# EAGLE design Strain gauge (EAGLE 5.12)
PARTNO: 43045-0615

## Sheet 1 of 2
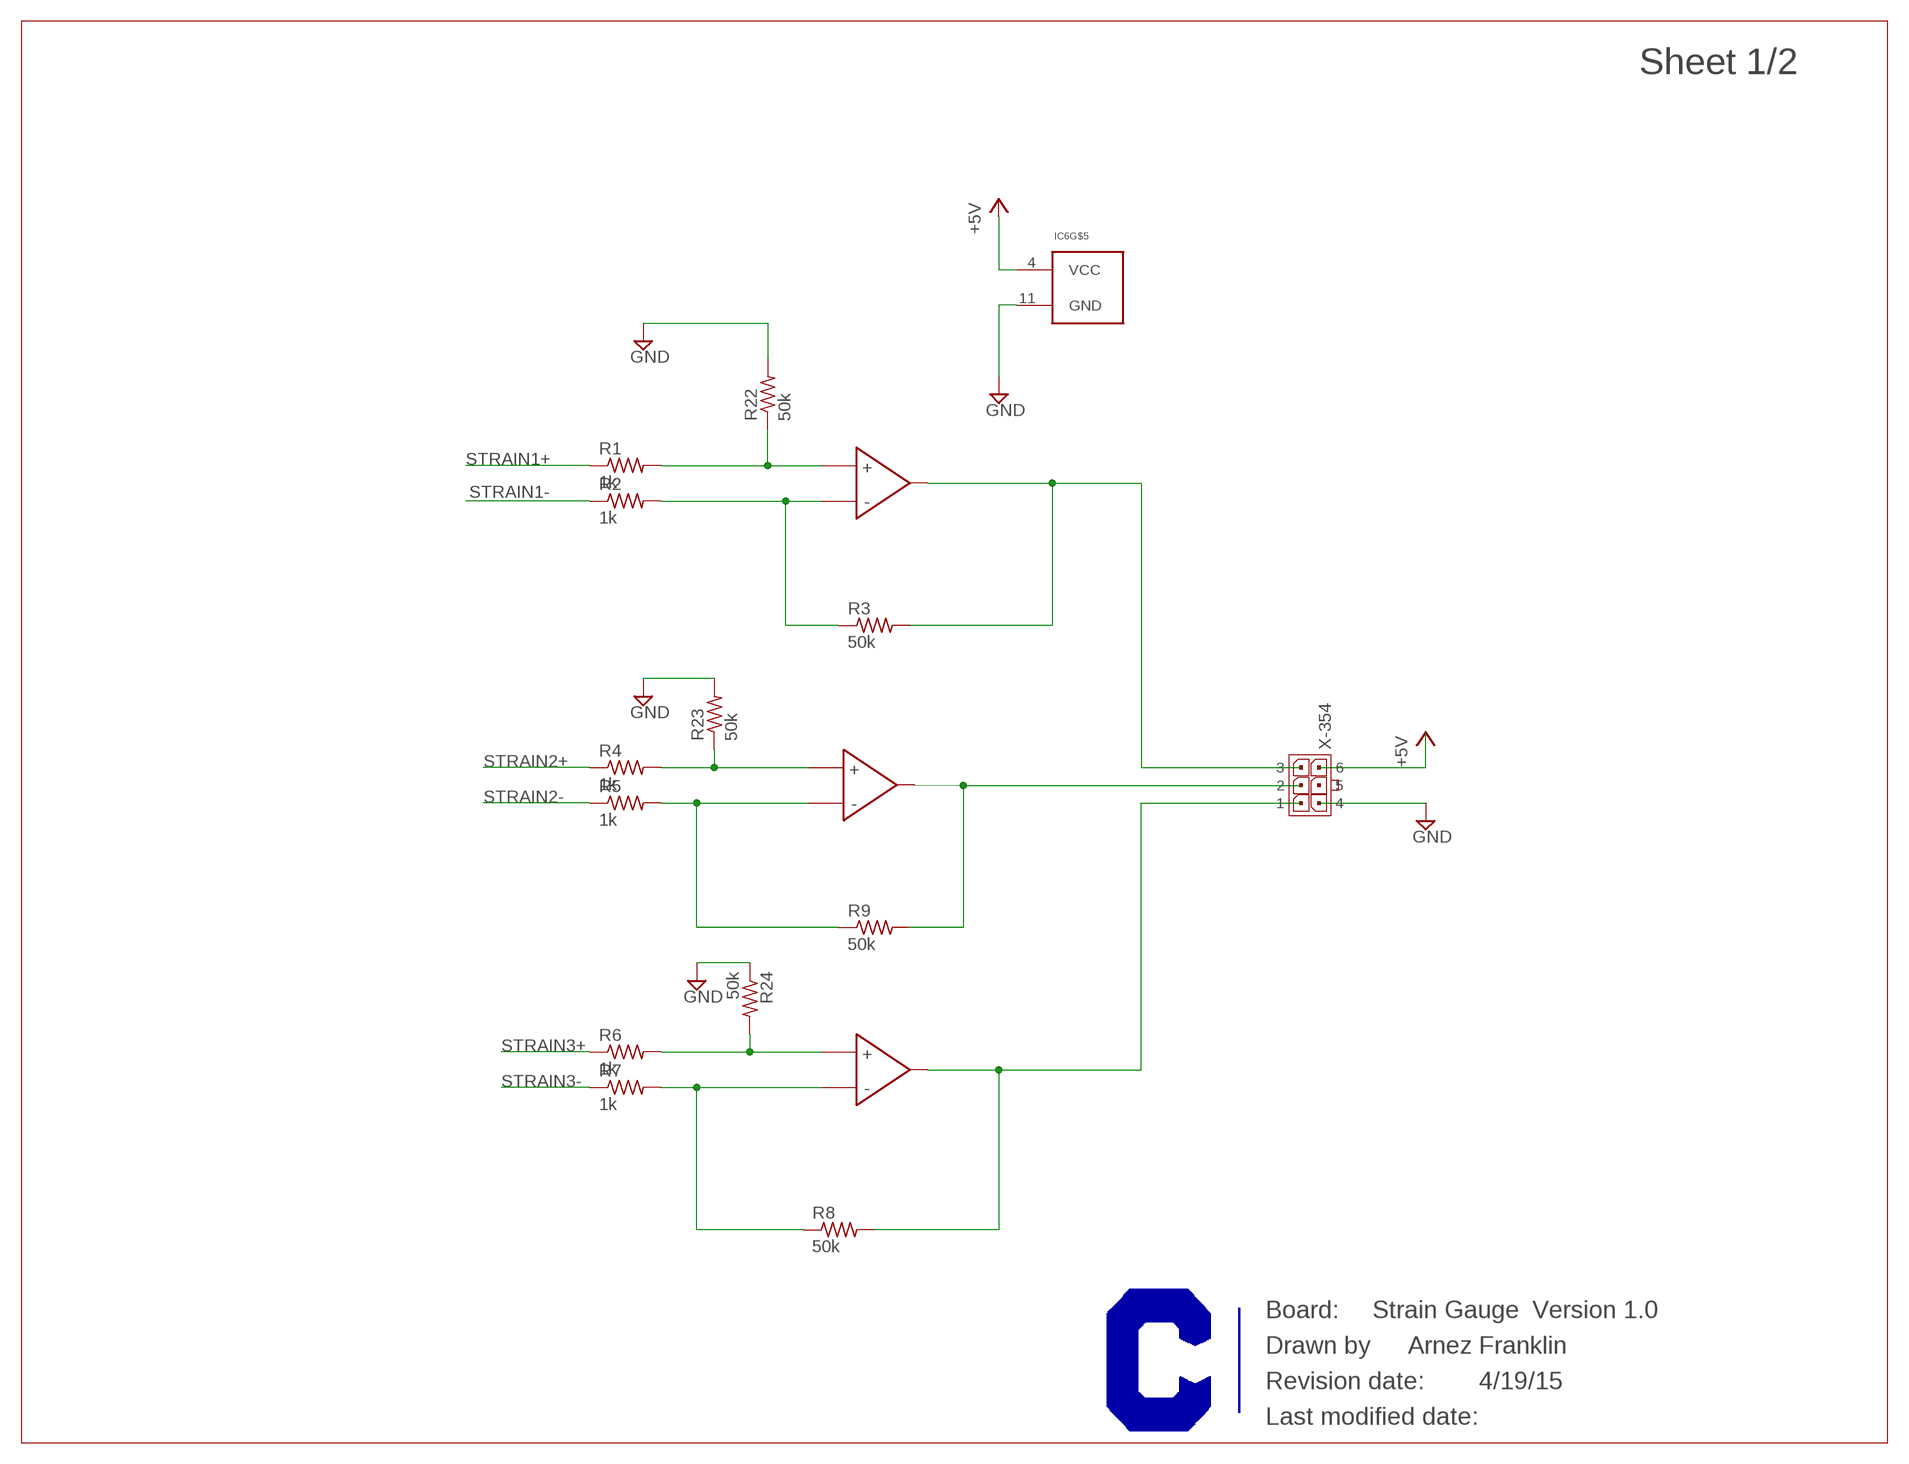
[diagram p0: schematic, sheet 1]

### Parts
IC6  TLV2764IPWR  [PW_(R-PDSO-G14)_(TSSOP-14)]
R1  1k  R-US_R0603  [R0603]
R2  1k  R-US_R0603  [R0603]
R3  50k  R-US_R0603  [R0603]
R4  1k  R-US_R0603  [R0603]
R5  1k  R-US_R0603  [R0603]
R6  1k  R-US_R0603  [R0603]
R7  1k  R-US_R0603  [R0603]
R8  50k  R-US_R0603  [R0603]
R9  50k  R-US_R0603  [R0603]
R22  50k  R-US_R0603  [R0603]
R23  50k  R-US_R0603  [R0603]
R24  50k  R-US_R0603  [R0603]
U$1  CURRENT-C-LETTER-LANDSCAPE  [BLANK]
X-354  MICROFIT-06-DUAL-RA-SMD-CLIP_RETENTION  [MICROFIT-6-DUAL-RA-SMD-CLIP_RETENTION]

### Nets
+5V: IC6.4(VCC) X-354.6 ; also sheet 2
GND: IC6.11(GND) R22.2 R23.2 R24.1 X-354.4 ; also sheet 2
N$1: IC6.3(IN+) R1.2 R22.1
N$2: IC6.2(IN-) R2.2 R3.1
N$3: IC6.7(OUT) R9.2 X-354.2
N$5: IC6.1(OUT) R3.2 X-354.3
N$11: IC6.14(OUT) R8.2 X-354.1
N$15: IC6.6(IN-) R5.2 R9.1
N$16: IC6.5(IN+) R4.2 R23.1
N$17: IC6.13(IN-) R7.2 R8.1
N$18: IC6.12(IN+) R6.2 R24.2
STRAIN1+: R1.1 ; also sheet 2
STRAIN1-: R2.1 ; also sheet 2
STRAIN2+: R4.1 ; also sheet 2
STRAIN2-: R5.1 ; also sheet 2
STRAIN3+: R6.1 ; also sheet 2
STRAIN3-: R7.1 ; also sheet 2
Unconnected: IC6.8(OUT) IC6.9(IN-) IC6.10(IN+) X-354.5

### Notes on the sheet
- Strain Gauge | Version 1.0
- Arnez Franklin
- 4/19/15

## Sheet 2 of 2
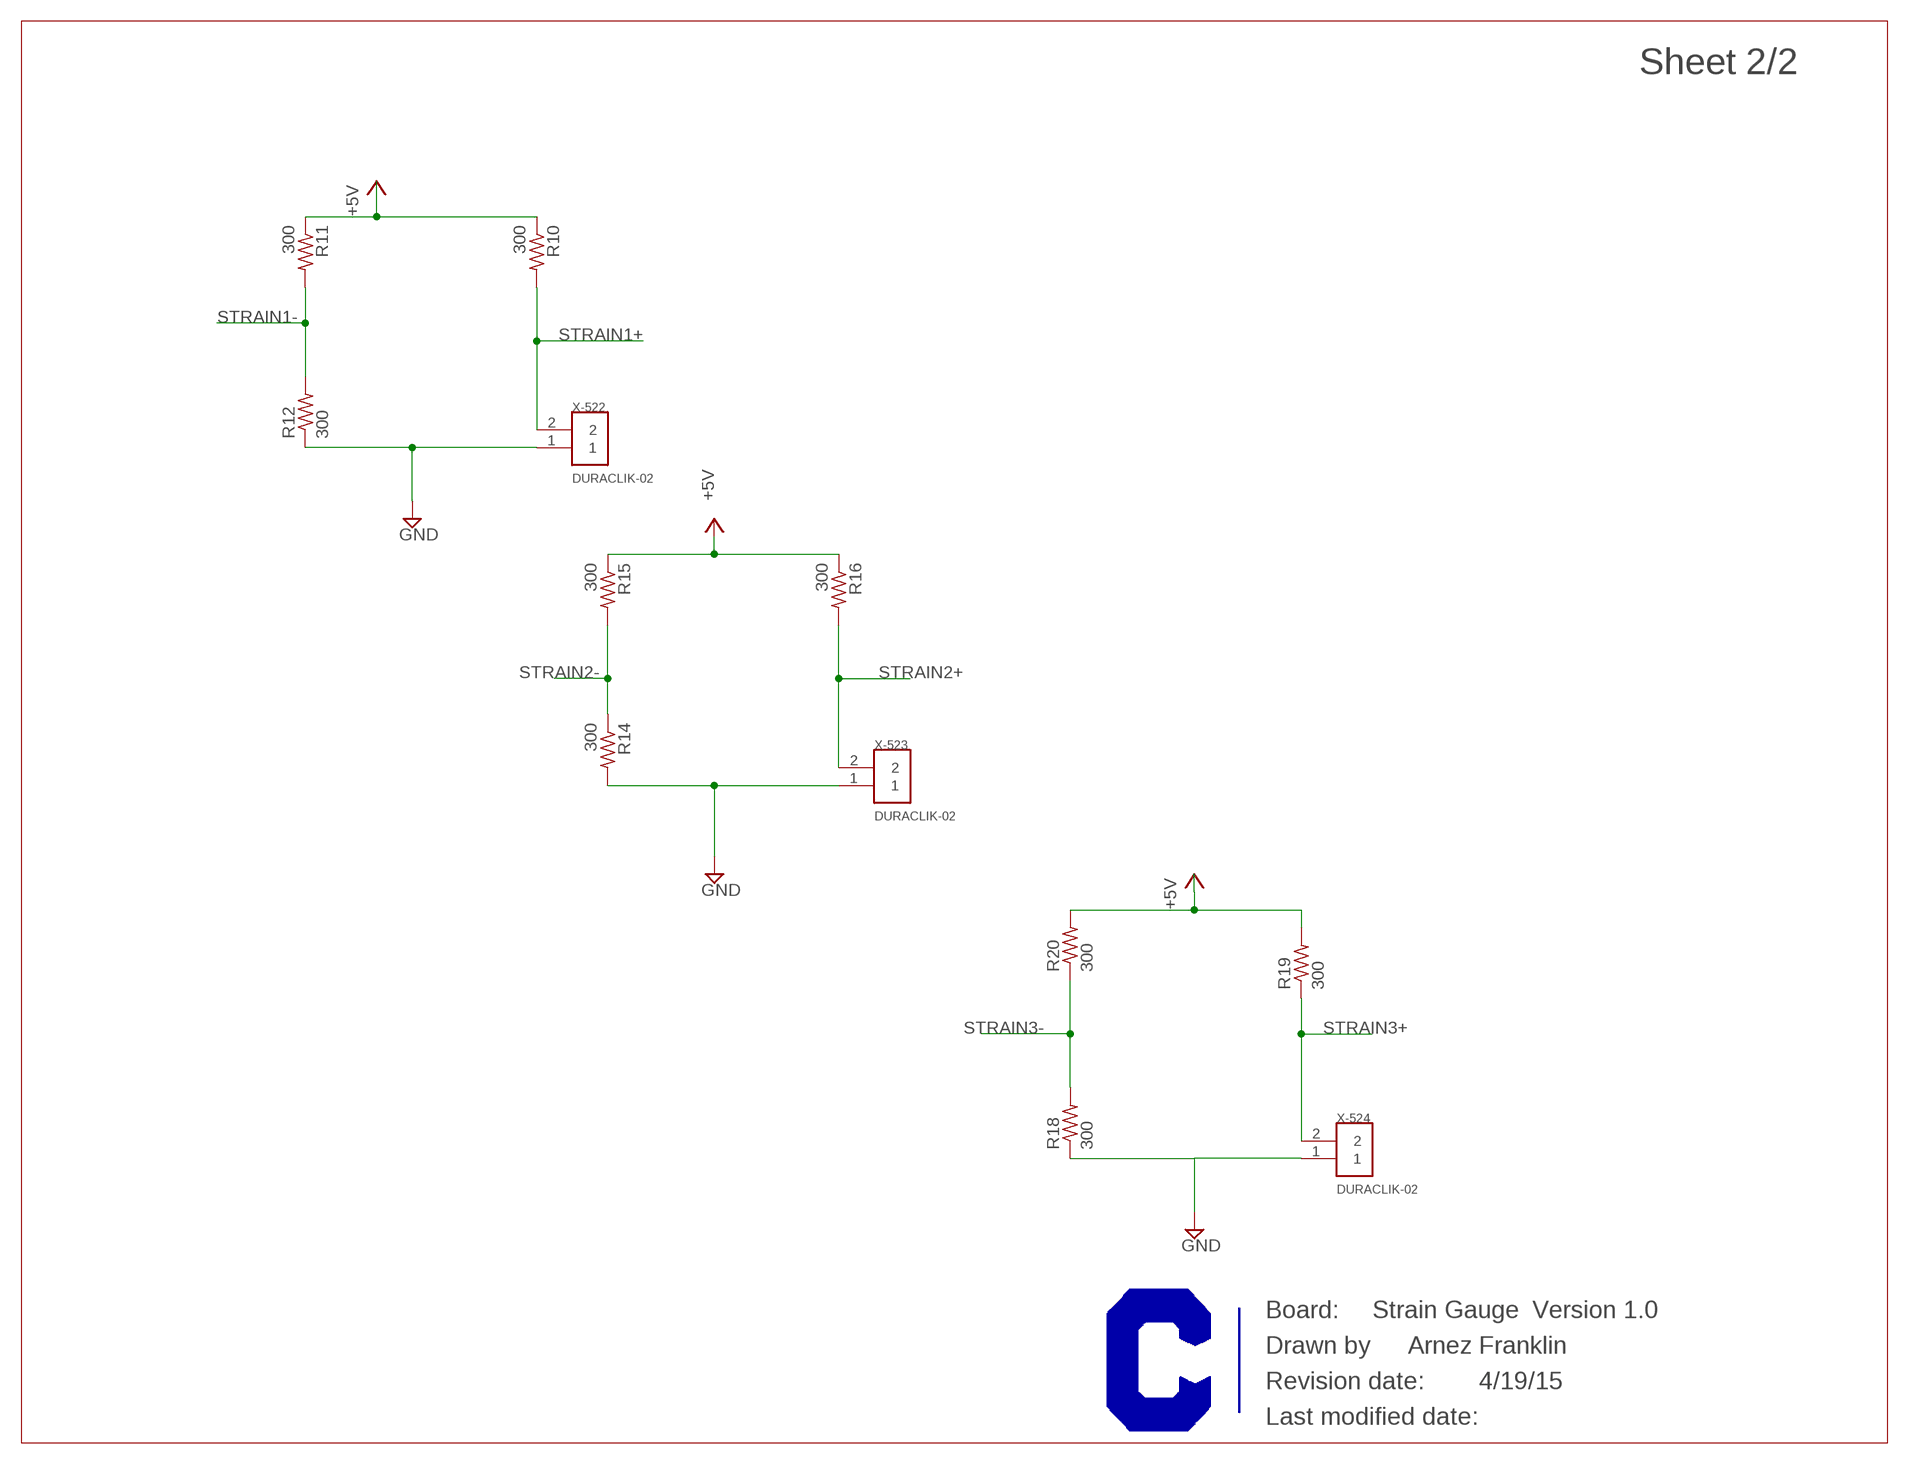
[diagram p1: schematic, sheet 2]

### Parts
R10  300  R-US_R0603  [R0603]
R11  300  R-US_R0603  [R0603]
R12  300  R-US_R0603  [R0603]
R14  300  R-US_R0603  [R0603]
R15  300  R-US_R0603  [R0603]
R16  300  R-US_R0603  [R0603]
R18  300  R-US_R0603  [R0603]
R19  300  R-US_R0603  [R0603]
R20  300  R-US_R0603  [R0603]
U$5  CURRENT-C-LETTER-LANDSCAPE  [BLANK]
X-522  DURACLIK-02  [DURACLIK-02]
X-523  DURACLIK-02  [DURACLIK-02]
X-524  DURACLIK-02  [DURACLIK-02]

### Nets
+5V: R10.1 R11.1 R15.1 R16.1 R19.2 R20.2 ; also sheet 1
GND: R12.1 R14.2 R18.1 X-522.1 X-523.1 X-524.1 ; also sheet 1
STRAIN1+: R10.2 X-522.2 ; also sheet 1
STRAIN1-: R11.2 R12.2 ; also sheet 1
STRAIN2+: R16.2 X-523.2 ; also sheet 1
STRAIN2-: R14.1 R15.2 ; also sheet 1
STRAIN3+: R19.1 X-524.2 ; also sheet 1
STRAIN3-: R18.2 R20.1 ; also sheet 1

### Notes on the sheet
- Strain Gauge | Version 1.0
- Arnez Franklin
- 4/19/15

## Library data of the parts
IC6 = TI:TLV2764: TLV2764 - Micropower, Rail-to-Rail Input/Output Op-Amps with Shutdown Datasheet: http://www.ti.com/lit/ds/symlink/tlv2764.pdf; PARTNO: TLV2764IPWR
R1-R12 R14-R16 R18-R20 = rcl:R-US_: RESISTOR, American symbol
R22-R24 = resistor:R-US_: RESISTOR, American symbol
U$1 U$5 = Frames:CURRENT-C-LETTER-LANDSCAPE; BOM: EXCLUDE
X-354 = Molex:MICROFIT-06-DUAL: Molex MicroFit 3.00mm Pitch Header, Surface Mount, Dual Row, 6 Circuits Note, November 2014: These come in three styles: Through-hole, with metal clip retention to PCB (not currently represented) (cheapest) SMD, with solder tab retention (-SMD) (more expensive, commonly stocked) SMD, with metal clip retention (-SMD-CLIP_RETENTION) (most expensive, not often stocked) Please use them in that order! Drawing: http://www.molex.com/pdm_docs/sd/430450609_sd.pdf (right-angle) Information: http://www.molex.com/molex/products/datasheet.jsp?part=active/0430450618_PCB_HEADERS.xml; PARTNO: 43045-0621
X-522-X-524 = BMC components:DURACLIK-02: MOLEX DuraClik Wire-to-Board Header, Single Row, Right Angle, 2 Circuits Drawing: 5023520600_sd.pdf <http://www.molex.com/pdm_docs/sd/5023520600_sd.pdf> Information: 502352-0200 <http://www.molex.com/molex/products/datasheet.jsp?part=active/5023520200_PCB_HEADERS.xml>

## Board
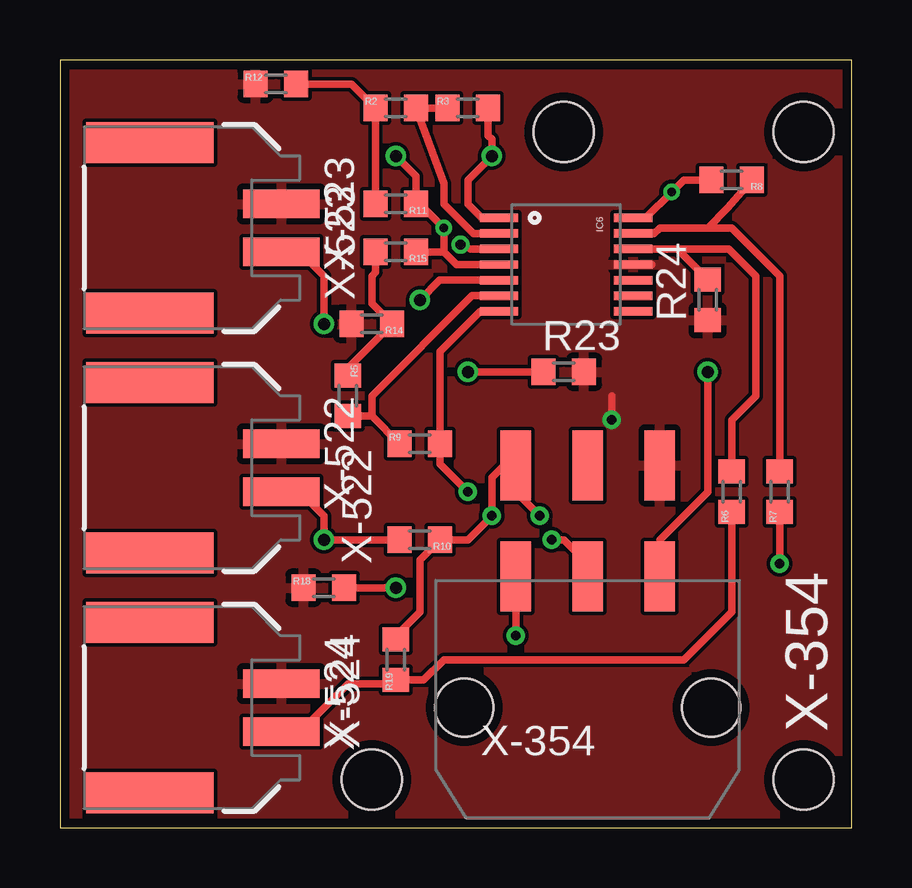
[diagram p2: board, top side]
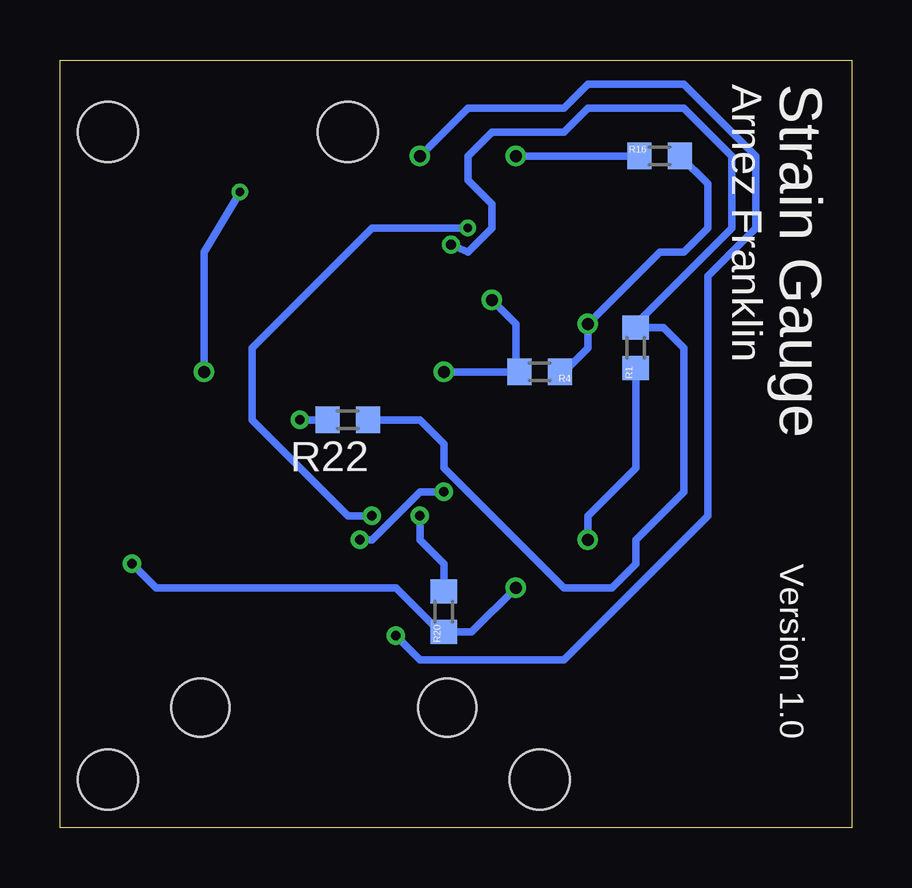
[diagram p3: board, bottom side, seen from below]

Size 33 x 32 mm. Coordinates in mm from the lower left corner, seen from the top.
Outline: 0,0 33,0 33,32 0,32 0,0
Copper layers (1*16): Top 0.0356mm / dielectric 1.5011mm / Bottom 0.0356mm
Design rules "OSH Park 2-layer": minimum track width 6mil, minimum drill 13mil, track to track 6mil, track to pad 6mil, pad to pad 6mil, via to via 6mil, smd to smd 6mil, copper to edge 15mil, drill to drill 6mil, minimum pad ring 7mil, minimum via ring 7mil, stop-mask expansion 4mil, vias tented up to drill 25mil, thermal gap 10mil
Holes 2.5 mm at 21,29 31,29 13,2 31,2

### Footprints (pad centres in the part's own frame; a part is rotated, then mirrored left to right if it is on the bottom)
PW_(R-PDSO-G14)_(TSSOP-14) = smd 0.35 x 1.6: 1 -1.95,-2.8; 2 -1.3,-2.8; 3 -0.65,-2.8; 4 0,-2.8; 5 0.65,-2.8; 6 1.3,-2.8; 7 1.95,-2.8; 8 1.95,2.8; 9 1.3,2.8; 10 0.65,2.8; 11 0,2.8; 12 -0.65,2.8; 13 -1.3,2.8; 14 -1.95,2.8
R0603 = smd 1 x 1.1: 1 -0.85,0; 2 0.85,0
MICROFIT-6-DUAL-RA-SMD-CLIP_RETENTION = smd 1.27 x 2.921: 1 3,5.47; 2 0,5.47; 3 -3,5.47; 4 3,10.1; 5 0,10.1; 6 -3,10.1 | hole 2.413: 5.144,0; -5.144,0
DURACLIK-02 = smd 1.2 x 3.2: 1 -1,8.23; 2 1,8.23 | smd 1.7 x 5.3: P$3 -3.55,2.75; P$4 3.55,2.75

### Placement (x,y rotation side)
IC6  21.1,23.47 270 top
R1  9,20 90 bottom
R2  14,30 0 top
R3  17,30 0 top
R4  13,19 180 bottom
R5  12,18 270 top
R6  28,14 90 top
R7  30,14 90 top
R8  28,27 180 top
R9  15,16 0 top
R10  15,12 180 top
R11  14,26 180 top
R12  9,31 0 top
R14  13,21 180 top
R15  14,24 180 top
R16  8,28 0 bottom
R18  11,10 0 top
R19  14,7 90 top
R20  17,9 90 bottom
R22  21,17 180 bottom
R23  21,19 0 top
R24  27,22 90 top
U$1  -21.67,-8.74 0 top  (outside the outline)
U$5  -24.21,-8.74 0 top  (outside the outline)
X-354  22,5 0 top
X-522  1,15 270 top
X-523  1,25 270 top
X-524  1,5 270 top

### Tracks (layer width: path | path; a pad name or v marks a point on that pad's centre or on a via)
+5V  (via drill 0.34, 0.4, 0.5)
  Top 0.305: v14,28 14.85,27.15 R11.1 15,26 v16,25 16,24 | 16,24 R15.1 | IC6.4 16.53,23.47 16,24 | R19.2 14,8 15,9 15,11.15 R10.1 17,12 v18,13 18,14.59 18.51,15.1 X-354.6 19,14 v20,13
  Bottom 0.305: R20.2 17,11 18,12 v18,13 | v16,25 20,25 25,20 25,17 21,13 v20,13 | v14,28 R16.1
GND  (via drill 0.4)
  Top 0.305: X-524.1 10,6 | IC6.11 24.68,23.47 | v23,17 23,18
  Bottom 0.305: R22.2 v23,17
  pour Top: 0,32 33,32 33,0 0,0
N$1  (via drill 0.4)
  Top 0.305: IC6.3 17.12,24.12 v16.7,24.3
  Bottom 0.305: R22.1 18,17 17,16 17,15 12,10 10,10 9,11 9,12 7,14 7,20 7.85,20.85 R1.2 9,21 5,25 5,28 7,30 11,30 12,29 15,29 16,28 16,27 15,26 15,25 16,24 v16.7,24.3
N$2
  Top 0.305: IC6.2 17.23,24.77 16,26 16,26.85 R2.2 R3.1
N$3  (via drill 0.4)
  Top 0.305: IC6.7 17.52,21.52 15.85,19.85 R9.2 15.85,15.15 v17,14 | v20.5,12 21,11.98 22,10.98 X-354.2
  Bottom 0.305: v17,14 18,14 20,12 v20.5,12
N$5  (via drill 0.4, 0.5)
  Top 0.305: R3.2 17.85,28.85 18,28.7 v18,28 17,27 17,26 17.58,25.42 IC6.1 | 19,11 19.01,10.99 19,10.98 X-354.3 v19,8
  Top 0.406: v19,8 v19.01,8.01
  Bottom 0.305: v18,28 16,30 12,30 11,31 7,31 4,28 4,25 6,23 6,13 12,7 18,7 v19,8
N$11  (via drill 0.35, 0.5)
  Top 0.305: IC6.14 24.42,25.42 v25.5,26.5 26,27 R8.2 | v27,19 27,14 25,12 X-354.1
  Bottom 0.305: v25.5,26.5 27,24 v27,19
N$15
  Top 0.305: R5.2 13,17.15 | 13,17.15 R9.1 | 13,17.15 13,18 17.17,22.17 IC6.6
N$16  (via drill 0.5)
  Top 0.305: v15,22 15.82,22.82 IC6.5 | v17,19 R23.1
  Bottom 0.305: v15,22 14,21 14,19.15 R4.2 v17,19
N$17
  Top 0.305: IC6.13 24.77,24.77 25,25 27,25 | 27,25 28,25 30,23 R7.2 | R8.1 27.85,25.85 27,25
N$18
  Top 0.305: R24.2 25.73,24.12 IC6.12 27.88,24.12 29,23 29,18 28,17 R6.2
STRAIN1+  (via drill 0.5)
  Top 0.305: X-522.2 10,14 11,13 v11,12 R10.2
  Bottom 0.305: R1.1 9,15 11,13 v11,12
STRAIN1-
  Top 0.305: R12.2 12.15,31 R2.1 R11.2
STRAIN2+  (via drill 0.5)
  Top 0.305: v11,21 11,23 10,24 X-523.2
  Bottom 0.305: R4.1 12,19 11,20 v11,21 8,24 7,24 6,25 6,26.85 R16.2
STRAIN2-
  Top 0.305: R15.2 13.15,23.15 13,23 13,21.85 R14.1 12,19.15 R5.1
STRAIN3+
  Top 0.305: R6.1 28,9 26,7 16,7 15.15,6.15 R19.1 13.85,6 12,6 10,4 X-524.2
STRAIN3-  (via drill 0.4, 0.5)
  Top 0.305: R18.2 v14,10 | v30,11 R7.1
  Bottom 0.305: v14,10 15.85,8.15 R20.1 17.15,8.15 19,10 29,10 v30,11

### Text on the board
tPlace: X-523 | X-522 | X-354 | X-524
bPlace: Strain Gauge | Arnez Franklin | Version 1.0